# Altium schematic sheet Arbolito.SchDoc
size A4
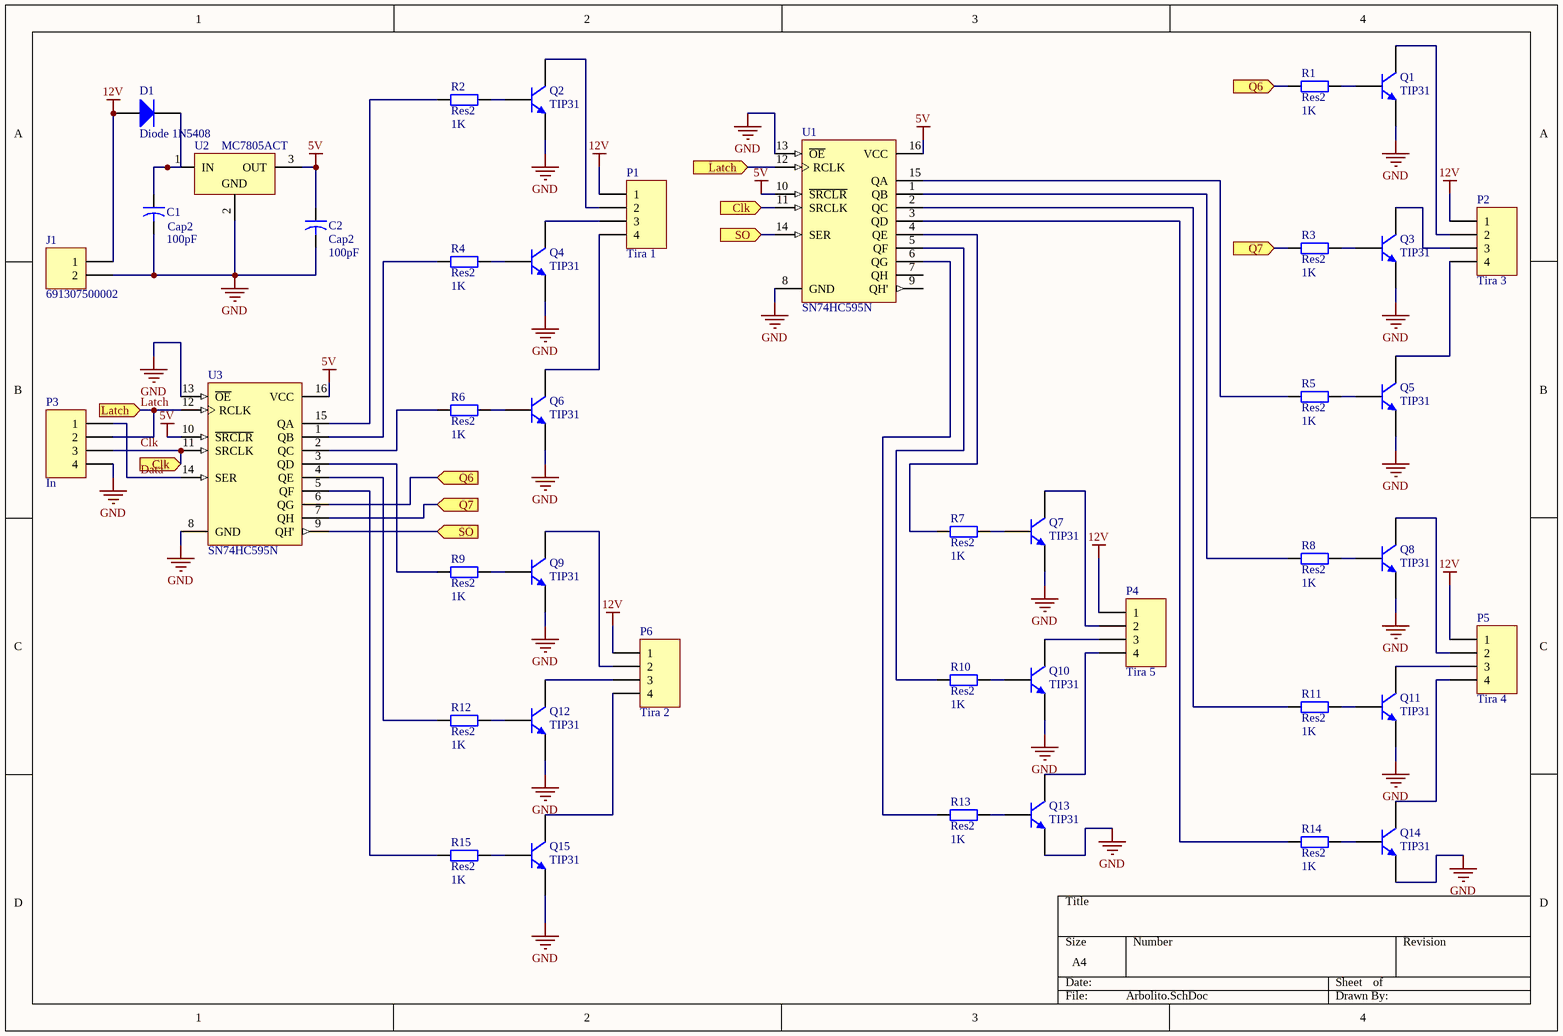
[diagram p0: Arbolito.SchDoc]

## Parts
C1  Cap2  value 100pF  [CAPR5-4X5]
C2  Cap2  value 100pF  [CAPR5-4X5]
D1  Diode 1N5408  [DO-201AD]
J1  691307500002  [691307500002]
P1  Tira 1  [HDR1X4]
P2  Tira 3  [HDR1X4]
P3  In  [HDR1X4]
P4  Tira 5  [HDR1X4]
P5  Tira 4  [HDR1X4]
P6  Tira 2  [HDR1X4]
Q1  TIP31  [TO-220-AB]
Q2  TIP31  [TO-220-AB]
Q3  TIP31  [TO-220-AB]
Q4  TIP31  [TO-220-AB]
Q5  TIP31  [TO-220-AB]
Q6  TIP31  [TO-220-AB]
Q7  TIP31  [TO-220-AB]
Q8  TIP31  [TO-220-AB]
Q9  TIP31  [TO-220-AB]
Q10  TIP31  [TO-220-AB]
Q11  TIP31  [TO-220-AB]
Q12  TIP31  [TO-220-AB]
Q13  TIP31  [TO-220-AB]
Q14  TIP31  [TO-220-AB]
Q15  TIP31  [TO-220-AB]
R1  Res2  value 1K  [AXIAL-0.4]
R2  Res2  value 1K  [AXIAL-0.4]
R3  Res2  value 1K  [AXIAL-0.4]
R4  Res2  value 1K  [AXIAL-0.4]
R5  Res2  value 1K  [AXIAL-0.4]
R6  Res2  value 1K  [AXIAL-0.4]
R7  Res2  value 1K  [AXIAL-0.4]
R8  Res2  value 1K  [AXIAL-0.4]
R9  Res2  value 1K  [AXIAL-0.4]
R10  Res2  value 1K  [AXIAL-0.4]
R11  Res2  value 1K  [AXIAL-0.4]
R12  Res2  value 1K  [AXIAL-0.4]
R13  Res2  value 1K  [AXIAL-0.4]
R14  Res2  value 1K  [AXIAL-0.4]
R15  Res2  value 1K  [AXIAL-0.4]
U1  SN74HC595N  [N016]
U2  MC7805ACT  [221A-04]
U3  SN74HC595N  [N016]

## Ports
Clk, Latch, Q6, Q6 (in), Q7, SO

## Nets
5V: C2.1 U1.10(~{SRCLR}) U1.16(VCC) U2.3(OUT) U3.10(~{SRCLR}) U3.16(VCC)
12V: D1.1(A) J1.1 P1.1 P2.1 P4.1 P5.1 P6.1
GND: C1.2 C2.2 J1.2 P3.4 Q1.1(E) Q2.1(E) Q3.1(E) Q4.1(E) Q5.1(E) Q6.1(E) Q7.1(E) Q8.1(E) Q9.1(E) Q10.1(E) Q11.1(E) Q12.1(E) Q13.1(E) Q14.1(E) Q15.1(E) U1.8(GND) U1.13(~{OE}) U2.2(GND) U3.8(GND) U3.13(~{OE})
Clk: P3.3 U1.11(SRCLK) U3.11(SRCLK) ; port Clk
Data: P3.1 U3.14(SER)
Latch: P3.2 U1.12(RCLK) U3.12(RCLK) ; port Latch
Q6: R1.1 U3.6(QG) ; port Q6
Q7: R3.1 U3.7(QH) ; port Q7
SO: U1.14(SER) U3.9(QH') ; port SO
NetC1_1: C1.1 D1.2(K) U2.1(IN)
NetP1_2: P1.2 Q2.3(C)
NetP1_3: P1.3 Q4.3(C)
NetP1_4: P1.4 Q6.3(C)
NetP2_2: P2.2 Q1.3(C)
NetP2_3: P2.3 Q3.3(C)
NetP2_4: P2.4 Q5.3(C)
NetP4_2: P4.2 Q7.3(C)
NetP4_3: P4.3 Q10.3(C)
NetP4_4: P4.4 Q13.3(C)
NetP5_2: P5.2 Q8.3(C)
NetP5_3: P5.3 Q11.3(C)
NetP5_4: P5.4 Q14.3(C)
NetP6_2: P6.2 Q9.3(C)
NetP6_3: P6.3 Q12.3(C)
NetP6_4: P6.4 Q15.3(C)
NetQ1_2: Q1.2(B) R1.2
NetQ2_2: Q2.2(B) R2.2
NetQ3_2: Q3.2(B) R3.2
NetQ4_2: Q4.2(B) R4.2
NetQ5_2: Q5.2(B) R5.2
NetQ6_2: Q6.2(B) R6.2
NetQ7_2: Q7.2(B) R7.2
NetQ8_2: Q8.2(B) R8.2
NetQ9_2: Q9.2(B) R9.2
NetQ10_2: Q10.2(B) R10.2
NetQ11_2: Q11.2(B) R11.2
NetQ12_2: Q12.2(B) R12.2
NetQ13_2: Q13.2(B) R13.2
NetQ14_2: Q14.2(B) R14.2
NetQ15_2: Q15.2(B) R15.2
NetR2_1: R2.1 U3.15(QA)
NetR4_1: R4.1 U3.1(QB)
NetR5_1: R5.1 U1.15(QA)
NetR6_1: R6.1 U3.2(QC)
NetR7_1: R7.1 U1.4(QE)
NetR8_1: R8.1 U1.1(QB)
NetR9_1: R9.1 U3.3(QD)
NetR10_1: R10.1 U1.5(QF)
NetR11_1: R11.1 U1.2(QC)
NetR12_1: R12.1 U3.4(QE)
NetR13_1: R13.1 U1.6(QG)
NetR14_1: R14.1 U1.3(QD)
NetR15_1: R15.1 U3.5(QF)

Not connected (* = marked no-connect by the designer): U1 7(QH) 9(QH')

## Library data of the parts
C1 C2 = Cap2: Capacitor; Published: 23-Sep-2002; PackageReference: CAPR5-4X5; Publisher: Altium Limited; PackageDescription: Capacitor; 2 Leads
D1 = Diode 1N5408: 3 Amp Medium Power Silicon Rectifier Diode; Published: 8-Jun-2000; LatestRevisionDate: 17-Jul-2002; LatestRevisionNote: Re-released for DXP Platform.; DatasheetVersion: Aug-1984; PackageReference: DO-201AD; Publisher: Altium Limited; PackageDescription: Diode, Axial; Body 9.5 x 5.3 mm (LxDia. max), Lead Dia. 1.32 mm (max); ComponentLink1Description: Manufacturer Link; ComponentLink1URL: http://www.irf.com/
J1 = 691307500002: WR-TBL Terminal block - serie 3075; Manufacturer: Würth Elektronik eiSos GmbH; ComponentLink1 Description: Manufacturer; ComponentLink2 Description: Datasheet; NoPins: 02; Created Date: 09 April 2014; partNo: 691307500002; ComponentLink1URL: http://www.we-online.com; ComponentLink2URL: http://katalog.we-online.de/em/datasheet/6913075000xx.pdf; Created by: Karrer Zheng
P1-P6 = Header 4: Header, 4-Pin; LatestRevisionDate: 17-Jul-2002; LatestRevisionNote: Re-released for DXP Platform.; Publisher: Altium Limited
Q1-Q15 = 2N3904: NPN General Purpose Amplifier; pin to pad: 1>3 2>1 3>2; Published: 8-Jun-2000; LatestRevisionDate: 15-Jan-2003; LatestRevisionNote: PCB Footprint 'BCY-W3/D4.7' replaced; DatasheetVersion: 1997; PackageVersion: Sep-1998; PackageReference: TO-92A; Publisher: Altium Limited; PackageDescription: TO, Flat Index; 3 In-Line, Axial Leads; Body Dia. 4.5mm; Leads 0.51 x 0.48 mm (max); ComponentLink1Description: Manufacturer Link; ComponentLink1URL: http://www.fairchildsemi.com/; ComponentLink2Description: Datasheet; ComponentLink2URL: http://www.fairchildsemi.com/ds/2N%2F2N3904.pdf
R1-R15 = Res2: Resistor; Published: 8-Jun-2000; LatestRevisionDate: 17-Jul-2002; LatestRevisionNote: Re-released for DXP Platform.; PackageReference: AXIAL-0.4; Publisher: Altium Limited; PackageDescription: Axial Device, Thru-Hole; 2 Leads; 0.4 in Pin Spacing
U1 U3 = SN74HC595N: 8-Bit Shift Register with 3-State Output Registers; Published: 8-Jun-2000; LatestRevisionDate: 04-Mar-2005; LatestRevisionNote: Stylized 3D Model Added.; DatasheetVersion: May-1997; PackageVersion: Oct-1995; PackageReference: N016; Publisher: Altium Limited; PackageDescription: DIP; 16 Leads; Row Spacing 7.62 mm; Pitch 2.54 mm; Code_JEDEC: MS-001-BB; ComponentLink1Description: Manufacturer Link; ComponentLink1URL: http://www.ti.com/; ComponentLink2Description: Datasheet; ComponentLink2URL: http://www-s.ti.com/sc/ds/sn74hc595.pdf
U2 = MC7805ACT: 3-Terminal Positive Fixed Voltage Regulator; Note: Pin 2 is electrically connected to TAB; Published: 17-Jul-2002; DatasheetVersion: 1988; PackageReference: 221A-04; Publisher: Altium Limited; PackageDescription: TO, Thru-Hole, Vertical, Heatsink Mounted; 3 In-Line Leads; Pitch 2.54 mm; Code_JEDEC: TO-262-AA; ComponentLink1Description: Manufacturer Link; ComponentLink1URL: http://www.onsemi.com/site/products/taxonomy/0,4438,503,00.html; ComponentLink2Description: Datasheet; ComponentLink2URL: http://www.onsemi.com/pub/Collateral/MC7800-D.PDF